# Altium schematic sheet IDD_measurement.SchDoc: IDD measurement / MFX (Multi Function eXpander)
size A4; Date: 01-DEC-2013; Author: A.B; CompanyName: STMicroelectronics; Organization: Microcontrollers Division; Address1: 12, Rue Jules HOROWITZ; Address2: 38019 Grenoble; Address3: FRANCE; DocumentNumber: MB1184; Revision: C-01; SheetNumber: 4; SheetTotal: 10; Project: STM32L476G-DISCO
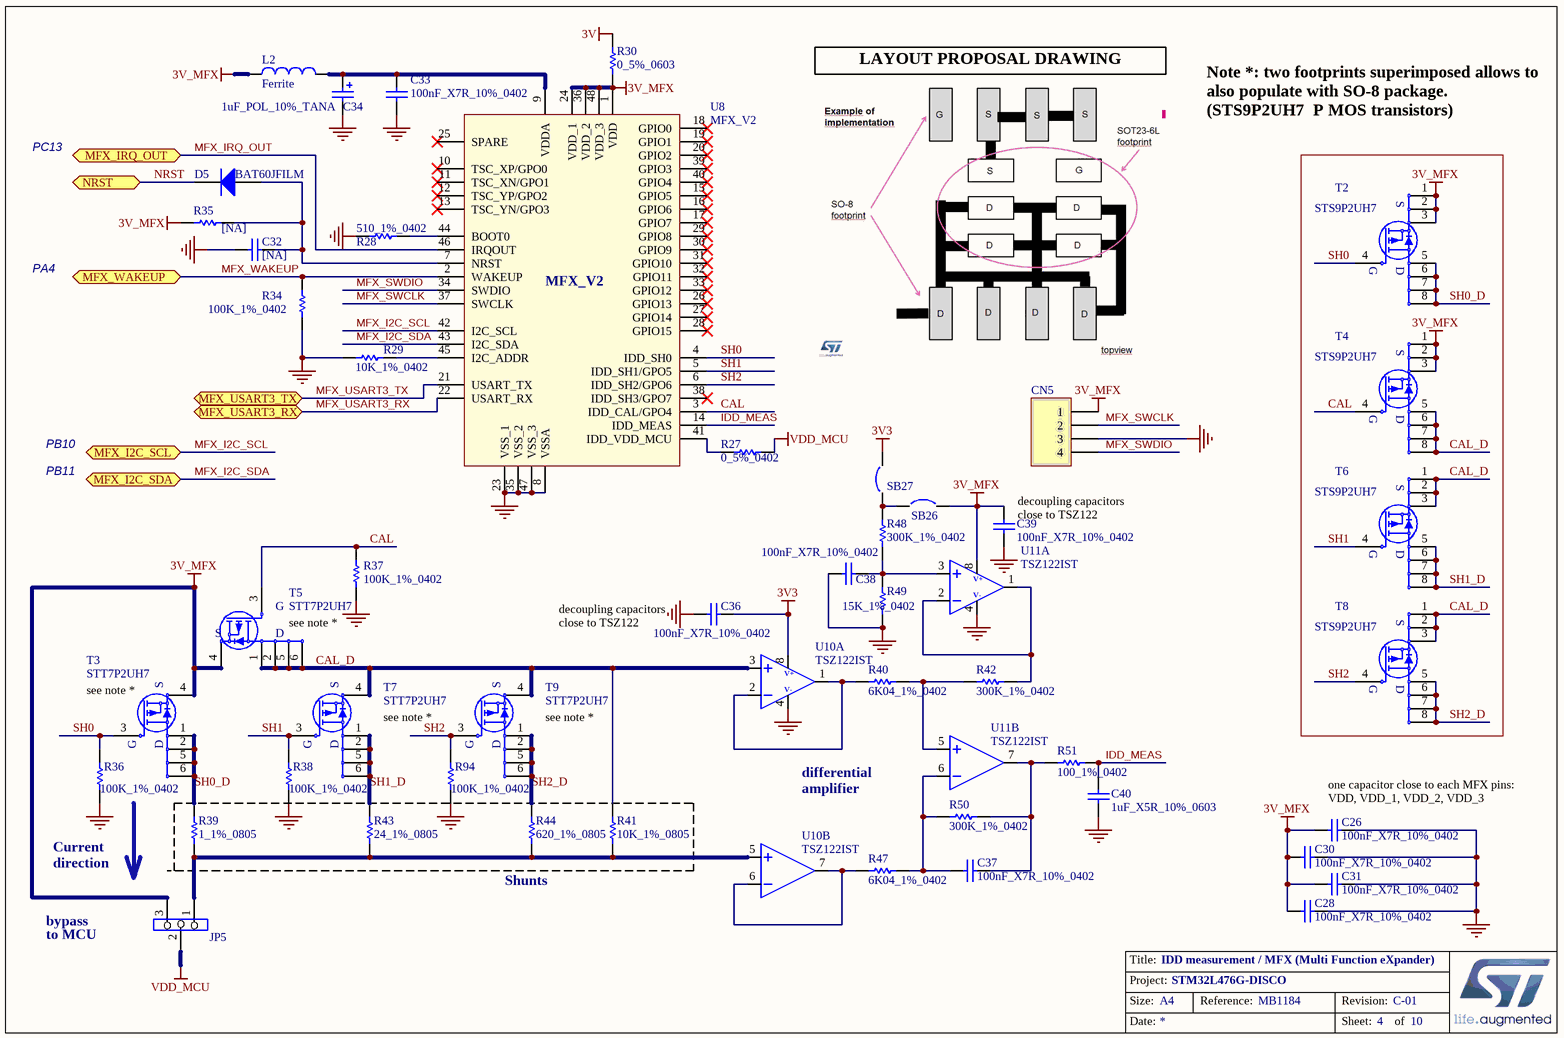
[diagram p0: IDD_measurement.SchDoc]

## Parts
C26  100nF_X7R_10%_0402  [0402C]
C28  100nF_X7R_10%_0402  [0402C]
C30  100nF_X7R_10%_0402  [0402C]
C31  100nF_X7R_10%_0402  [0402C]
C32  [NA]  [0402C]
C33  100nF_X7R_10%_0402  [0402C]
C34  1uF_POL_10%_TANA  [TAN-A]
C36  100nF_X7R_10%_0402  [0402C]
C37  100nF_X7R_10%_0402  [0402C]
C38  100nF_X7R_10%_0402  [0402C]
C39  100nF_X7R_10%_0402  [0402C]
C40  1uF_X5R_10%_0603  [0603C]
CN5  Header 4  [Header 4]  (value not drawn)
D5  BAT60JFILM  [SOD323/A]
JP5  Jumper 3 pins  [SIP3]  (value not drawn)
L2  Ferrite  [0603L]
R27  0_5%_0402  [0402R]
R28  510_1%_0402  [0402R]
R29  10K_1%_0402  [0402R]
R30  0_5%_0603  [0603R-GS]
R34  100K_1%_0402  [0402R]
R35  [NA]  [0402R]
R36  100K_1%_0402  [0402R]
R37  100K_1%_0402  [0402R]
R38  100K_1%_0402  [0402R]
R39  1_1%_0805  [0805R]
R40  6K04_1%_0402  [0402R]
R41  10K_1%_0805  [0805R]
R42  300K_1%_0402  [0402R]
R43  24_1%_0805  [0805R]
R44  620_1%_0805  [0805R]
R47  6K04_1%_0402  [0402R]
R48  300K_1%_0402  [0402R]
R49  15K_1%_0402  [0402R]
R50  300K_1%_0402  [0402R]
R51  100_1%_0402  [0402R]
R94  100K_1%_0402  [0402R]
SB26  Circuit Breaker  [JP2_SMD]  (value not drawn)
SB27  Circuit Breaker  [JP2_SMD]  (value not drawn)
T2  STS9P2UH7  [SO8]
T3  STT7P2UH7  [SOT23-6L]
T4  STS9P2UH7  [SO8]
T5  STT7P2UH7  [SOT23-6L]
T6  STS9P2UH7  [SO8]
T7  STT7P2UH7  [SOT23-6L]
T8  STS9P2UH7  [SO8]
T9  STT7P2UH7  [SOT23-6L]
U8  MFX_V2  [QFP48 7X7]
U10  TSZ122IST  [miniSO8]  (parts A,B of 2)
U11  TSZ122IST  [miniSO8]  (parts A,B of 2)

## Ports
MFX_I2C_SCL, MFX_I2C_SDA, MFX_IRQ_OUT, MFX_USART3_RX, MFX_USART3_TX, MFX_WAKEUP, NRST

## Nets
3V: R30.2
3V3: C36.2 SB27.2 U10.8
3V_MFX: C26.1 C28.1 C30.1 C31.1 C39.2 CN5.1 JP5.3 L2.1 R30.1 R35.1 SB26.2 T2.1(S) T2.2(S) T2.3(S) T3.4(S) T4.1(S) T4.2(S) T4.3(S) T5.4(S) U8.1(VDD) U8.24(VDD_1) U8.36(VDD_2) U8.48(VDD_3) U11.8
GND: C26.2 C28.2 C30.2 C31.2 C32.1 C33.1 C34.2 C36.1 C38.1 C39.1 C40.1 CN5.3 R28.1 R29.1 R34.1 R36.1 R37.1 R38.1 R49.1 R94.1 U8.8(VSSA) U8.23(VSS_1) U8.35(VSS_2) U8.47(VSS_3) U10.4 U11.4
VDD_MCU: JP5.2 R27.2
CAL: R37.2 T4.4(G) T5.3(G) U8.3(IDD_CAL/GPO4)
CAL_D: R41.2 T4.5(D) T4.6(D) T4.7(D) T4.8(D) T5.1(S) T5.2(S) T5.5(D) T5.6(D) T6.1(S) T6.2(S) T6.3(S) T7.4(S) T8.1(S) T8.2(S) T8.3(S) T9.4(S) U10.3
IDD_MEAS: C40.2 R51.2 U8.14(IDD_MEAS)
MFX_I2C_SCL: U8.42(I2C_SCL) ; port MFX_I2C_SCL
MFX_I2C_SDA: U8.43(I2C_SDA) ; port MFX_I2C_SDA
MFX_IRQ_OUT: U8.46(IRQOUT) ; port MFX_IRQ_OUT
MFX_SWCLK: CN5.2 U8.37(SWCLK)
MFX_SWDIO: CN5.4 U8.34(SWDIO)
MFX_USART3_RX: U8.22(USART_RX) ; port MFX_USART3_RX
MFX_USART3_TX: U8.21(USART_TX) ; port MFX_USART3_TX
MFX_WAKEUP: R34.2 U8.2(WAKEUP) ; port MFX_WAKEUP
NRST: D5.2(K) ; port NRST
SH0: R36.2 T2.4(G) T3.3(G) U8.4(IDD_SH0)
SH0_D: R39.2 T2.5(D) T2.6(D) T2.7(D) T2.8(D) T3.1(S) T3.2(S) T3.5(D) T3.6(D)
SH1: R38.2 T6.4(G) T7.3(G) U8.5(IDD_SH1/GPO5)
SH1_D: R43.2 T6.5(D) T6.6(D) T6.7(D) T6.8(D) T7.1(S) T7.2(S) T7.5(D) T7.6(D)
SH2: R94.2 T8.4(G) T9.3(G) U8.6(IDD_SH2/GPO6)
SH2_D: R44.2 T8.5(D) T8.6(D) T8.7(D) T8.8(D) T9.1(S) T9.2(S) T9.5(D) T9.6(D)
NetC32_2: C32.2 D5.1(A) R35.2 U8.7(NRST)
NetC33_2: C33.2 C34.1 L2.2 U8.9(VDDA)
NetC37_1: C37.1 R47.2 R50.1 U11.6
NetC37_2: C37.2 R50.2 R51.1 U11.7
NetC38_2: C38.2 R48.1 R49.2 U11.3
NetJP5_1: JP5.1 R39.1 R41.1 R43.1 R44.1 U10.5
NetR27_1: R27.1 U8.41(IDD_VDD_MCU)
NetR28_2: R28.2 U8.44(BOOT0)
NetR29_2: R29.2 U8.45(I2C_ADDR)
NetR40_1: R40.1 U10.1 U10.2
NetR40_2: R40.2 R42.1 U11.5
NetR42_2: R42.2 U11.1 U11.2
NetR47_1: R47.1 U10.6 U10.7
NetR48_2: R48.2 SB26.1 SB27.1

Not connected (* = marked no-connect by the designer): U8 10(TSC_XP/GPO0)* 11(TSC_XN/GPO1)* 12(TSC_YP/GPO2)* 13(TSC_YN/GPO3)* 15(GPIO5)* 16(GPIO6)* 17(GPIO7)* 18(GPIO0)* 19(GPIO1)* 20(GPIO2)* 25(SPARE)* 26(GPIO13)* 27(GPIO14)* 28(GPIO15)* 29(GPIO8)* 30(GPIO9)* 31(GPIO10)* 32(GPIO11)* 33(GPIO12)* 38(IDD_SH3/GPO7)* 39(GPIO3)* 40(GPIO4)*

## Notes on the sheet
- LAYOUT PROPOSAL DRAWING
- PC13
- Note *: two footprints superimposed allows to also populate with SO-8 package.
  (STS9P2UH7  P MOS transistors)
- PA4
- PB10
- PB11
- (near C39) decoupling capacitors
  close to TSZ122
- (near T5) see note *
- (near C36) decoupling capacitors
  close to TSZ122
- (near T3) see note *
- see note *
- (near T9) see note *
- differential
  amplifier
- (near C26) one capacitor close to each MFX pins: VDD, VDD_1, VDD_2, VDD_3
- Current direction
- Shunts
- to MCU
- bypass
- Title:
- Project:
- Size:
- Date:
- A4
- Reference:
- Sheet:
- Revision:
- of
- (in symbol TSZ122IST, part A) V+; V-

## Library data of the parts
C26 C28 C30 C31 C33 C36-C39 = Cap_100nF_X7R_10%_0402: Capacitor,100nF,16V,X7R,10%,0402,YAGEO; Manuf_Part_1: CC0402KRX7R7BB104; Revision: July-2002: Re-released for DXP Platform.; Value: 100nF; Order: CC0402KRX7R7BB104; Manuf_1: YAGEO; ECCN_US/EU: n/a
C32 = Cap_NA_0402: Capacitor,NA,0402; Fitted: NO; Revision: July-2002: Re-released for DXP Platform.; Value: [NA]; ECCN_US/EU: n/a
C34 = Cap_1uF_POL_10%_TANA: Polarized Capacitor,1uF,16V,10%,typeA,AVX; Manuf_Part_1: TAJA105K016R; Revision: July-2002: Re-released for DXP Platform.; Value: 1uF; Manuf_1: AVX; Distrib: *; Order: TAJA105K016R; ECCN_US/EU: n/a
C40 = Cap_1uF_X5R_10%_0603: Capacitor,1uF,16V,X5R,10%,0603,YAGEO; Manuf_Part_1: CC0603KRX5R7BB105; Revision: July-2002: Re-released for DXP Platform.; Value: 1uF; Order: CC0603KRX5R7BB105; Manuf_1: YAGEO; ECCN_US/EU: n/a
CN5 = Header 4: Header, 4-Pin; Fitted: NO; Revision: 17-Jul-2002: Re-released for DXP Platform.; Publisher: Altium Limited; ECCN_US/EU: n/a
D5 = BAT60JFILM: Manuf_1: STM; Provided: ST; ECCN_US/EU: EAR99/NEC; Ref St: 9151097; Revision: July-2002: Re-released for DXP Platform.; Order: BAT60JFILM; Manuf_Part_1: BAT60JFILM; Distrib: ST
JP5 = Jumper3: ECCN_US/EU: n/a
L2 = BEAD_600R_350MA_0603: Bead,600R,350mA,0603,FCM1608KF-601T03,Tai-tech; Manuf_2: TDK; Manuf_Part_2: MPZ1608S300A; Value: 100uH; Comment_1: bead,30R,5A,0603,MPZ1608S300A,TDK; Ordered by: Subcon; Revision: July-2002: Re-released for DXP Platform.; Manuf_Part_1: FCM1608KF-601T03; Order: FCM1608KF-601T03; Manuf_1: Tai-tech
R27 = Res_0_5%_0402: Resistor,0,0402,5%,YAGEO; Manuf_Part_1: RC0402JR-070RL; Value: 0; Order: 2363467; ECCN_US/EU: n/a; Manuf_1: YAGEO; Distrib: FARNELL
R28 = Res_510_1%_0402: Resistor,510,0402,1%,YAGEO; Manuf_Part_1: RC0402FR-07510L; Value: 510; Manuf_1: YAGEO; Order: RC0402FR-07510L; ECCN_US/EU: n/a; Distrib: DIGIKEY
R29 = Res_10K_1%_0402: Resistor,10K,0402,1%,YAGEO; Manuf_Part_1: RC0402FR-0710KL; Value: 10K; Manuf_1: YAGEO; Order: RC0402FR-0710KL; ECCN_US/EU: n/a
R30 = Res_0_5%_0603: Resistor,0,0603,5%,YAGEO; Manuf_Part_1: RC0603JR-070RL; Value: 0; Order: 2363481; ECCN_US/EU: n/a; Manuf_1: YAGEO; Distrib: FARNELL
R34 R36-R38 R94 = Res_100K_1%_0402: Resistor,100K,0402,1%,YAGEO; Manuf_Part_1: RT0402FRE07100KL; Value: 100K; Manuf_1: YAGEO; Order: RT0402FRE07100KL; ECCN_US/EU: n/a
R35 = Res_NA_0402: Resistor,[NA],0402; Fitted: NO; Value: [NA]; ECCN_US/EU: n/a
R39 = Res_1_1%_0805: Resistor,1,0805,1%,YAGEO; Manuf_Part_1: RC0805FR-071RL; Value: 1; Manuf_1: YAGEO; Order: RC0805FR-071RL; ECCN_US/EU: n/a
R40 R47 = Res_6K04_1%_0402: Resistor,6K04,0402,1%,YAGEO; Manuf_Part_1: RC0402FR-076K04L; Value: 6K04; Manuf_1: YAGEO; Order: RC0402FR-076K04L; ECCN_US/EU: n/a
R41 = Res_10K_1%_0805: Resistor,10K,0805,1%,YAGEO; Manuf_Part_1: RC0805FR-0710KL; Value: 10K; Manuf_1: YAGEO; Order: RC0805FR-0710KL; ECCN_US/EU: n/a
R42 R48 R50 = Res_300K_1%_0402: Resistor,300K,0402,1%,YAGEO; Manuf_Part_1: RC0402FR-07300KL; Value: 300K; Manuf_1: YAGEO; Order: RC0402FR-07300KL; ECCN_US/EU: n/a
R43 = Res_24_1%_0805: Resistor,24,0805,1%,YAGEO; Manuf_Part_1: RC0805FR-0724RL; Value: 24; Manuf_1: YAGEO; Order: RC0805FR-0724RL; ECCN_US/EU: n/a
R44 = Res_620_1%_0805: Resistor,620,0805,1%,YAGEO; Manuf_Part_1: RC0805FR-07620RL; Value: 620; Manuf_1: YAGEO; Order: RC0805FR-07620RL; ECCN_US/EU: n/a
R49 = Res_15K_1%_0402: Resistor,15K,0402,1%,YAGEO; Manuf_Part_1: RC0402FR-0715KL; Value: 15K; Manuf_1: YAGEO; Order: RC0402FR-0715KL; ECCN_US/EU: n/a
R51 = Res_100_1%_0402: Resistor,100,0402,1%,YAGEO; Manuf_Part_1: RC0402FR-07100RL; Value: 100; Order: 9239111; Manuf_1: YAGEO; ECCN_US/EU: n/a; Distrib: FARNELL
SB26 = Circuit Breaker: Solder: YES; Revision: July-2002: Re-released for DXP Platform.
SB27 = Circuit Breaker: Solder: NO; Revision: July-2002: Re-released for DXP Platform.
T2 = STS7P2UH7: STripFET VII Power MOSFET, P-CHANNEL 20V - 0.023 - 7A - SO-8; Manuf_1: STM; Provided: ST; Ref St: xxxxxxxx; ECCN_US/EU: EAR99/NEC; Fitted: NO; Comments: exclusive with T9; Manuf_Part_1: STS9P2UH7; Order: STS9P2UH7; Distrib: ST; Ordered by: STM
T3 = STT7P2UH7: STripFET VII DeepGATE Power MOSFET, P-CHANNEL 20 V, 0.0146, 7 A - SOT23-6L; Manuf_1: STM; Provided: ST; Ref St: xxxxxxxx; ECCN_US/EU: EAR99/NEC; Comments: exclusive with T8; Manuf_Part_1: STT7P2UH7; Order: STT7P2UH7; Distrib: ST; Ordered by: STM
T4 = STS7P2UH7: STripFET VII Power MOSFET, P-CHANNEL 20V - 0.023 - 7A - SO-8; Manuf_1: STM; Provided: ST; Ref St: xxxxxxxx; ECCN_US/EU: EAR99/NEC; Fitted: NO; Comments: exclusive with T5; Manuf_Part_1: STS9P2UH7; Order: STS9P2UH7; Distrib: ST; Ordered by: STM
T5 = STT7P2UH7: STripFET VII DeepGATE Power MOSFET, P-CHANNEL 20 V, 0.0146, 7 A - SOT23-6L; Manuf_1: STM; Provided: ST; Ref St: xxxxxxxx; ECCN_US/EU: EAR99/NEC; Comments: exclusive with T2; Manuf_Part_1: STT7P2UH7; Order: STT7P2UH7; Distrib: ST; Ordered by: STM
T6 = STS7P2UH7: STripFET VII Power MOSFET, P-CHANNEL 20V - 0.023 - 7A - SO-8; Manuf_1: STM; Provided: ST; Ref St: xxxxxxxx; ECCN_US/EU: EAR99/NEC; Fitted: NO; Comments: exclusive with T6; Manuf_Part_1: STS9P2UH7; Order: STS9P2UH7; Distrib: ST; Ordered by: STM
T7 = STT7P2UH7: STripFET VII DeepGATE Power MOSFET, P-CHANNEL 20 V, 0.0146, 7 A - SOT23-6L; Manuf_1: STM; Provided: ST; Ref St: xxxxxxxx; ECCN_US/EU: EAR99/NEC; Comments: exclusive with T3; Manuf_Part_1: STT7P2UH7; Order: STT7P2UH7; Distrib: ST; Ordered by: STM
T8 = STS7P2UH7: STripFET VII Power MOSFET, P-CHANNEL 20V - 0.023 - 7A - SO-8; Manuf_1: STM; Provided: ST; Ref St: xxxxxxxx; ECCN_US/EU: EAR99/NEC; Fitted: NO; Comments: exclusive with T7; Manuf_Part_1: STS9P2UH7; Order: STS9P2UH7; Distrib: ST; Ordered by: STM
T9 = STT7P2UH7: STripFET VII DeepGATE Power MOSFET, P-CHANNEL 20 V, 0.0146, 7 A - SOT23-6L; Manuf_1: STM; Provided: ST; Ref St: xxxxxxxx; ECCN_US/EU: EAR99/NEC; Comments: exclusive with T4; Manuf_Part_1: STT7P2UH7; Order: STT7P2UH7; Distrib: ST; Ordered by: STM
U8 = MFX_V2: MultiFunction eXpander (STM32L152CCT6); Manuf_1: STM; ECCN_US/EU: 3A991A2/NEC; Provided: ST; Order: STM32L152CCT6; Distrib: ST; Manuf_Part_1: STM32L152CCT6
U10 U11 = TSZ122IST: Very high accuracy (5 µV) zero drift 5 V dual OpAmp; Manuf_1: STM; ECCN_US/EU: EAR99/NEC; Provided: ST; Ref St: xxxxxxxxx; Manuf_Part_1: TSZ122IST; Distrib: ST; Order: TSZ122IST